# Altium project Hrafn.PrjPcb (part 3 of 3)

## Sheet Clock.SchDoc: Hrafn
size Tabloid; DrawnBy: Nicholas Belsten; Organization: MIT; Address1: Route 40; Address2: Westford MA 01886; Address3: USA; DocumentNumber: 6; Revision: 1.4; SheetNumber: 8; SheetTotal: 10; DCN: Aika; ProgramName: AERO-VISTA; Section: Clock
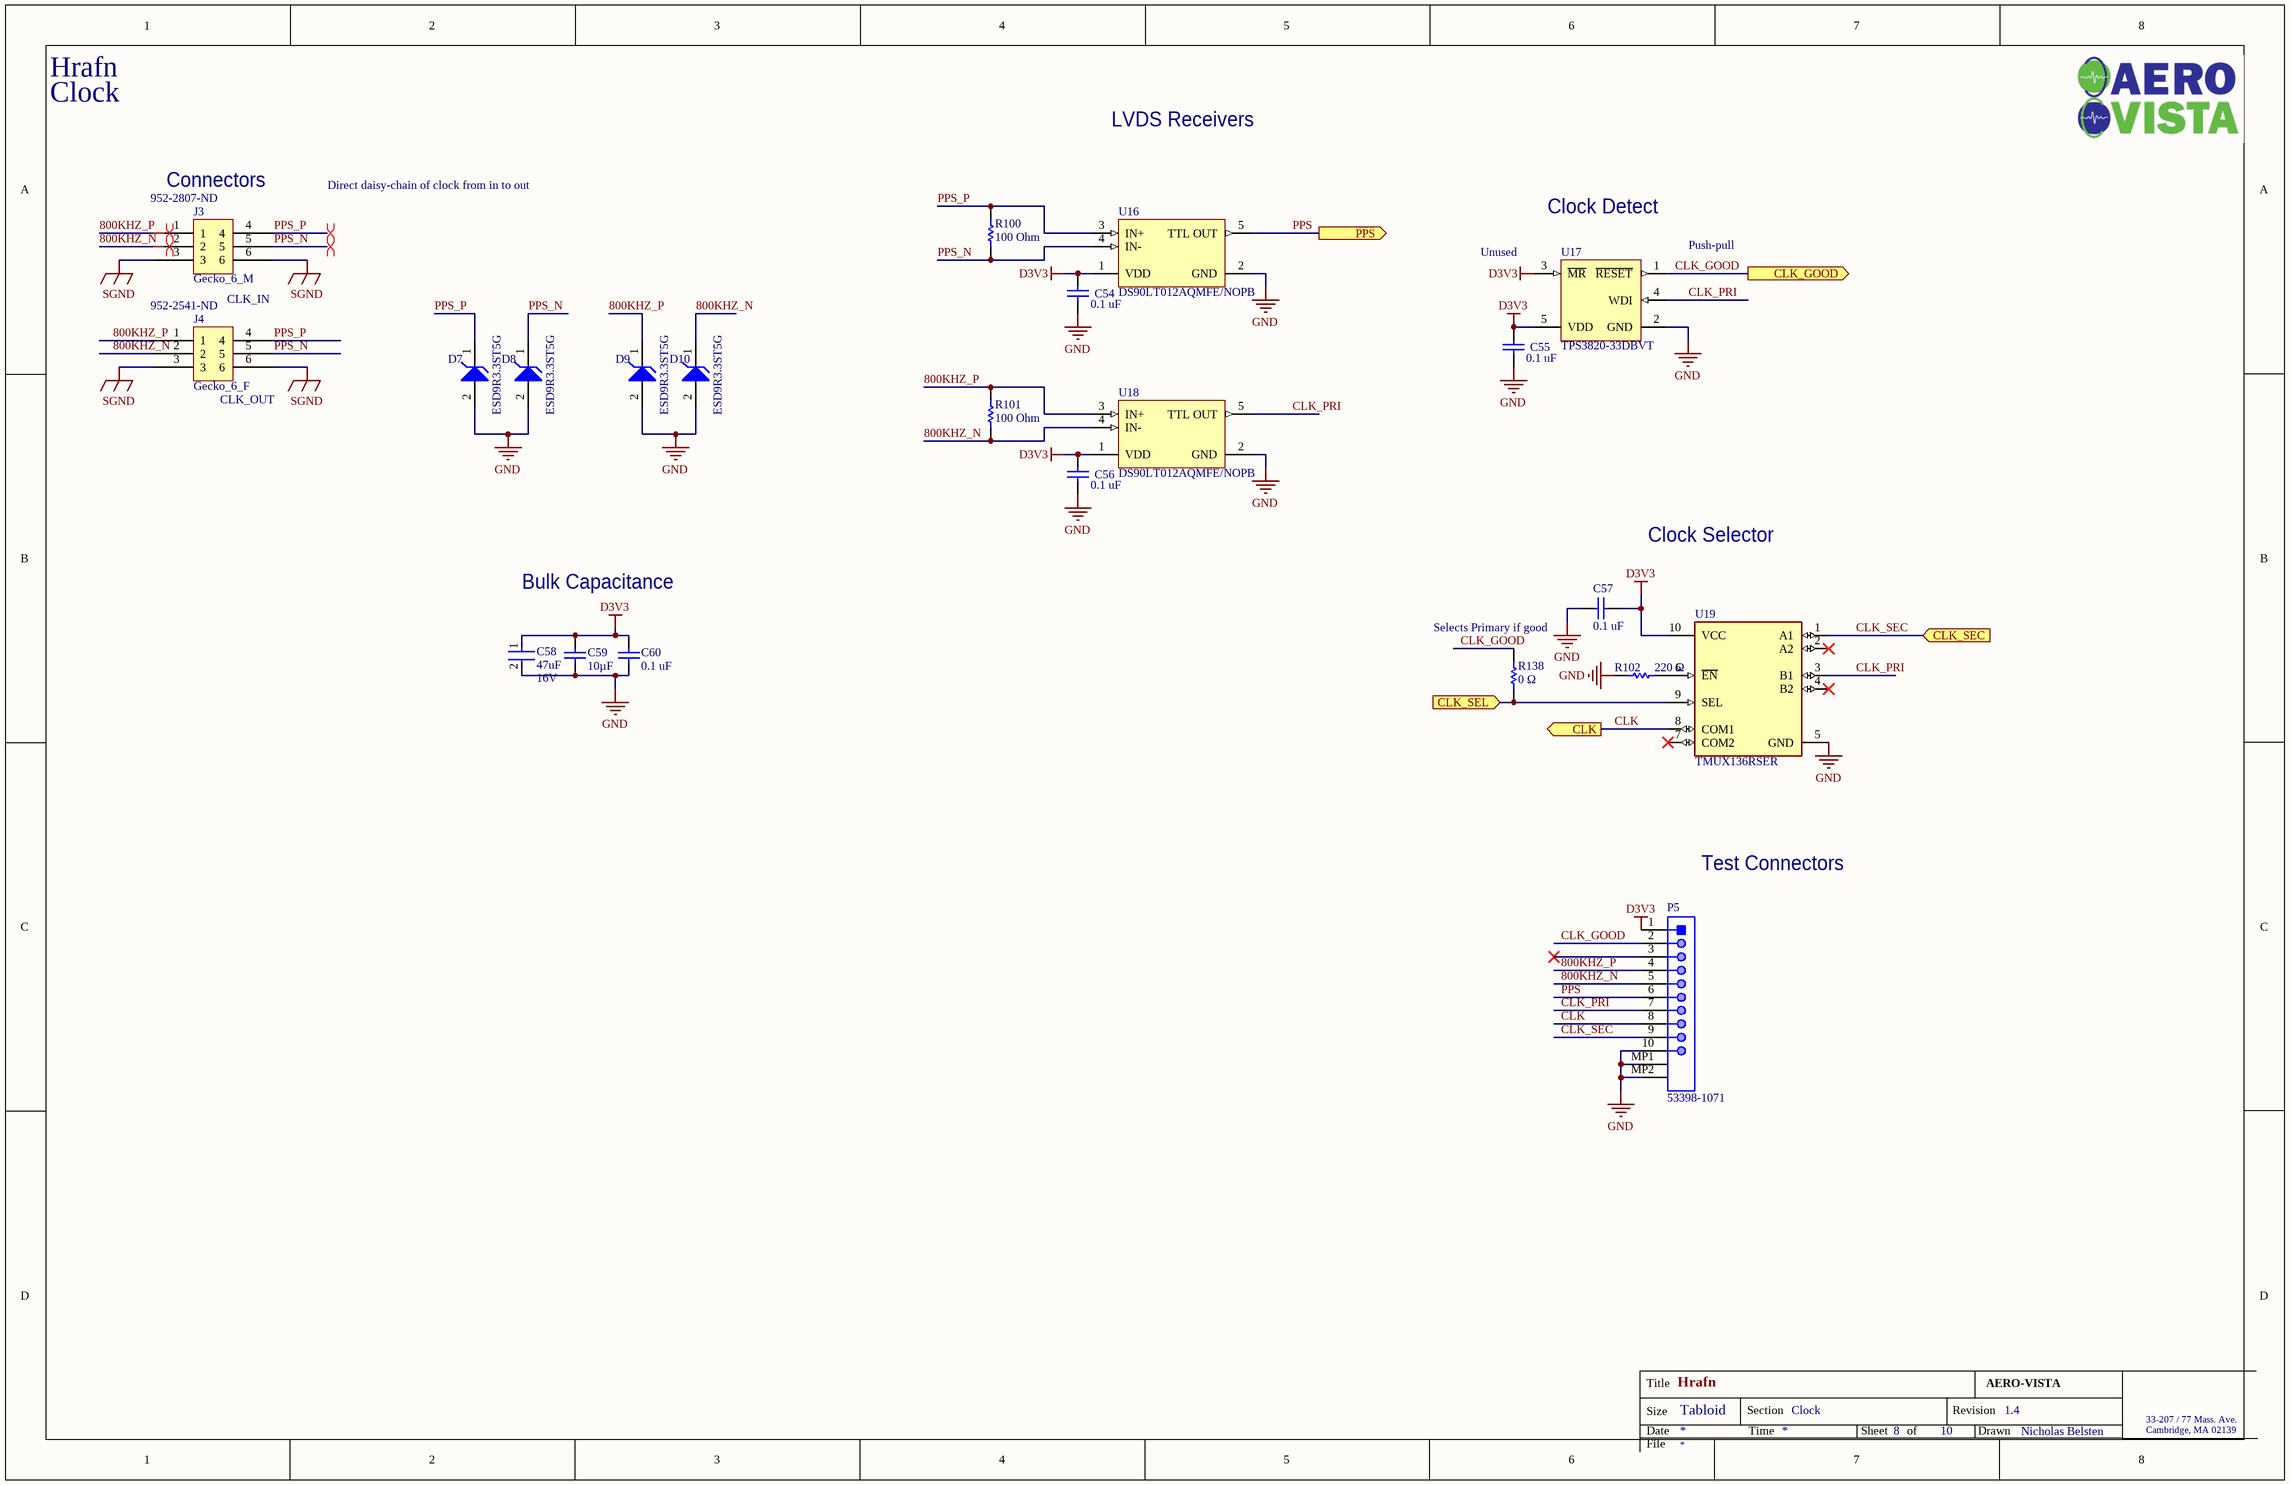
[diagram p8: Clock.SchDoc]

### Parts
C54  0.1 uF  [CAPC0402(1005)60_L]
C55  0.1 uF  [CAPC0402(1005)60_L]
C56  0.1 uF  [CAPC0402(1005)60_L]
C57  0.1 uF  [CAPC0402(1005)60_L]
C58  Capacitance: 47uF  Voltage Rating: 16V  [FP-GRT32E-0_3-IPC_C]  (hidden comment: GRT32EC81C476ME13L)
C59  Capacitance: 10µF  [CAPC1608X100X35LL20T25]  (hidden comment: EMK107BBJ106MA-T)
C60  0.1 uF  [CAPC0402(1005)60_L]
D7  ESD9R3.3ST5G  [ONSC-SOD-923-2-514AB-01_V]
D8  ESD9R3.3ST5G  [ONSC-SOD-923-2-514AB-01_V]
D9  ESD9R3.3ST5G  [ONSC-SOD-923-2-514AB-01_V]
D10  ESD9R3.3ST5G  [ONSC-SOD-923-2-514AB-01_V]
J3  Gecko_6_M  Supplier Part Number 1: 952-2807-ND  [GECK6_M]
J4  Gecko_6_F  Supplier Part Number 1: 952-2541-ND  [GECK6_F]
P5  53398-1071  [MOLX-53398-1071_V]
R100  100 Ohm  [RESC1005X40X25LL05T05]
R101  100 Ohm  [RESC1005X40X25LL05T05]
R102  220 Ω  [RESC1005X40X25LL05T05]
R138  Resistance: 0 Ω  [RESC1005X40X25LL05T05]  (hidden comment: ERJ2GE0R00X)
U16  DS90LT012AQMFE/NOPB  [MF05A_L]
U17  TPS3820-33DBVT  [DBV0005A_N]
U18  DS90LT012AQMFE/NOPB  [MF05A_L]
U19  TMUX136RSER  [FP-RSE0010A-MFG]

### Ports
CLK (out), CLK_GOOD (out), CLK_SEC (in), CLK_SEL (in), PPS (out)

### Nets
D3V3: C54.2 C55.2 C56.2 C57.1 C58.1 C59.2 C60.2 P5.1 U16.1(VDD) U17.3(~{MR}) U17.5(VDD) U18.1(VDD) U19.10(VCC)
GND: C54.1 C55.1 C56.1 C57.2 C58.2 C59.1 C60.1 D7.2(A) D8.2(A) D9.2(A) D10.2(A) P5.10 P5.MP1 P5.MP2 R102.1 U16.2(GND) U17.2(GND) U18.2(GND) U19.5(GND)  [project net DGND]
SGND: J3.3 J3.6 J4.3 J4.6
800KHZ_N: D10.1(K) J3.2 J4.2 P5.5 R101.1 U18.4(IN-)
800KHZ_P: D9.1(K) J3.1 J4.1 P5.4 R101.2 U18.3(IN+)
CLK: P5.8 U19.8(COM1) ; port CLK
CLK_GOOD: P5.2 R138.2 U17.1(~{RESET}) ; port CLK_GOOD
CLK_PRI: P5.7 U17.4(WDI) U18.5(TTL_OUT) U19.3(B1)
CLK_SEC: P5.9 U19.1(A1) ; port CLK_SEC
CLK_SEL: R138.1 U19.9(SEL) ; port CLK_SEL
PPS: P5.6 U16.5(TTL_OUT) ; port PPS
PPS_N: D8.1(K) J3.5 J4.5 R100.1 U16.4(IN-)
PPS_P: D7.1(K) J3.4 J4.4 R100.2 U16.3(IN+)
NetR102_2: R102.2 U19.6(~{EN})

Not connected (* = marked no-connect by the designer): P5 3*; U19 2(A2)* 4(B2)* 7(COM2)*

### Layout directives
differential pair; differential pair class LVDS: 800KHZ_N, 800KHZ_P, PPS_N, PPS_P

### Notes on the sheet
- LVDS Receivers
- (near J3) Connectors
- Direct daisy-chain of clock from in to out
- Clock Detect
- CLK_IN
- (near U17) Unused
- (near U17) Push-pull
- (near J4) CLK_OUT
- Clock Selector
- Bulk Capacitance
- Selects Primary if good
- Test Connectors
- Title
- Size
- Date
- Tabloid
- Section
- Time
- Sheet
- of
- Revision
- Drawn
- 33-207 / 77 Mass. Ave.
- Cambridge, MA 02139
- File

### Library data of the parts
C54-C57 C60 = CMP-1034-02068-1: CAP 100nF 16V ±5% 0402 (1005 Metric) Thickness 0.6mm SMD; Tolerance: Â±5%; Case-EIA: 0402; Case-Metric: 1005; Technology: SMT; Value: 100nF; Max Thickness: 0.6 mm; Rated Voltage: 16 V
C58 = CMP-06035-034903-1: Multi-Layer Ceramic Capacitor 47uF 16V X6S ±20% 1210 Emboss T/R; Ratings: AEC-Q200; Thickness: 0.106inch; Max Operating Temperature: 105°C; Width: 0.098inch; Case/Package: 1210; Length: 0.126inch; Mount: Surface Mount; Min Operating Temperature: -55°C; Tolerance: 20%; Case Code (Imperial): 1210; Case Code (Metric): 3225; Packaging: Tape and Reel
C59 = CMP-2000-06226-1: Chip Capacitor, 10 uF, +/- 20%, 16 V, -55 to 85 degC, 0603 (1608 Metric), RoHS, Tape and Reel; Manufacturer: Taiyo Yuden; Voltage - Rated: 16V; Temperature Coefficient: X5R; Other Names: 587-3238-6; Online Catalog: MSeries; Features: -; Thickness (Max): 0.031"(0.80mm); Package / Case: 0603(1608Metric); Datasheet URL: http://www.yuden.co.jp/ut/product/category/capacitor/EMK107BBJ106MA-T.pdf; Category: Capacitors; Lead Style: -; Family: CeramicCapacitors; Package Description: 2-Pin Surface Mount Device, Body 1.70 x 0.90 mm; Tolerance: ±20%; Manufacturer URL: http://www.t-yuden.com/; Operating Temperature: -55°C~85°C; Lead Spacing: -; Height - Seated (Max): -; Series: M; Applications: GeneralPurpose; Size / Dimension: 0.063"Lx0.031"W(1.60mmx0.80mm); Standard Package: 1; Packaging: Digi-Reel®; Mounting Technology: SurfaceMount; Package Reference: 0603; Ratings: -; Datasheet Version: 10/2016; Mounting Type: SurfaceMount,MLCC
D7-D10 = CMP-1063-00117-1: Transient Voltage Suppressor, ESD Protection Diode with Ultra-Low Leakage, 2-Pin SOD-923, Pb-Free, Tape and Reel; Manufacturer: On Semiconductor; C Max (pF): 0.9; V(BR) Min (V): 4.8; Number of Lines: 1; Direction: Unidirectional; IR Max (uA): 0.001; VRWM Max (V): 3.3; PackageReference: SOD-923-2-514AB-01; ComponentLink3URL: http://www.onsemi.com/pub_link/Collateral/514AB.PDF; DatasheetVersion: Rev. 1; PackageDescription: 2-Pin SOD, Body 0.8 x 0.6 mm; ComponentLink1URL: http://www.onsemi.com/; ComponentLink2Description: Datasheet; ComponentLink3Description: Package Specification; Packing: Tape and Reel; ComponentLink1Description: Manufacturer URL; ComponentLink2URL: http://www.onsemi.com/pub_link/Collateral/ESD9R3.3S-D.PDF; RoHS: Pb-Free; PackageVersion: Rev. C, 03/2011; Mounting Technology: Surface Mount; PartNumber: ESD9R3.3ST5G
J3 = Gecko_6_M: CONN HEADER VERT 6POS 1.25MM; Manufacturer 1: Harwin; Manufacturer Part Number 1: G125-MV10605L1P; Number of Positions: 6; Connector Type: Male Pin,Pin; Insulation Resistance: 10GR; Current Rating: 2A; Voltage Rating: 450V; Pitch: 0.049inch; Supplier 1: Digi-Key; RoHS: Yes; Category: Headers and Wire Housings; Stock 1: 132; Pricing 1: 1=4.22000, 10=4.04600, 100=3.37200, 500=2.86620, 1000=2.44470, 5000=2.19180 (USD); Mount: Through Hole; Color: Green; Weight: 0.008184oz; Housing Material: Polyamide; Contact Plating: Gold; Contact Material: Bronze; Min Operating Temperature: -65°C; Max Operating Temperature: 150°C; Packaging: Cut Strip; Termination: Solder; Fastening Type: Latch; Package Quantity: 1; Number of Rows: 2; Row Spacing: 0.049inch; Flammability Rating: UL94 V-0; ComponentLink1URL: http://www.mouser.com/ds/2/181/C125XX_G125_Gecko_Connectors-1131202.pdf?src-supplier=Mouser; ComponentLink1Description: http://www.mouser.com/ds/2/181/C125XX_G125_Gecko_Connectors-1131202.pdf?src-supplier=Mouser; ComponentLink2URL: https://cdn.harwin.com/pdfs/G125-MVXXX05LXP.pdf?src-supplier=Digi-Key; ComponentLink2Description: https://cdn.harwin.com/pdfs/G125-MVXXX05LXP.pdf?src-supplier=Digi-Key
J4 = Gecko_6_F: Gecko DIL Female Vertical 3mm PC Tail Connector, gold, pick & place (cut tape packing), 3+3 contacts; Manufacturer 1: Harwin; Manufacturer Part Number 1: G125-FV10605L0P; Current Rating: 2A; Voltage Rating: 450V; Connector Type: Receptacle,Socket; Number of Positions: 6; Insulation Resistance: 10GR; Pitch: 0.049inch; Supplier 1: Digi-Key; RoHS: Yes; Category: Headers and Wire Housings; Stock 1: 4137; Pricing 1: 1=6.94000, 10=6.64700, 100=5.49100, 500=4.62400, 1000=4.04600, 5000=3.75700 (USD); Mount: Through Hole; Housing Material: Polyamide; Contact Plating: Gold; Contact Material: Copper Alloy; Weight: 0.006843oz; Min Operating Temperature: -65°C; Max Operating Temperature: 150°C; Packaging: Bulk; Number of Rows: 2; Contact Gender: Female; Termination: Solder; Package Quantity: 1; Row Spacing: 0.049inch; Contact Post Length: 3mm; Flammability Rating: UL94 V-0; ComponentLink1URL: http://www.farnell.com/datasheets/1805453.pdf?src-supplier=Farnell; ComponentLink1Description: http://www.farnell.com/datasheets/1805453.pdf?src-supplier=Farnell; ComponentLink2URL: http://www.mouser.com/ds/2/181/C125XX_G125_Gecko_Connectors-1131202.pdf?src-supplier=Mouser; ComponentLink2Description: http://www.mouser.com/ds/2/181/C125XX_G125_Gecko_Connectors-1131202.pdf?src-supplier=Mouser; ComponentLink3URL: https://cdn.harwin.com/pdfs/G125-FVXXX05L0P.pdf?src-supplier=Digi-Key; ComponentLink3Description: https://cdn.harwin.com/pdfs/G125-FVXXX05L0P.pdf?src-supplier=Digi-Key; Parameter 1: *
P5 = CMP-2000-05635-1: Male Header, Pitch 1.25 mm, 1 x 10 Position, Height 4.7 mm, -40 to 85 degC, RoHS, Tape and Reel; Manufacturer: Molex; Mounting Angle: Vertical; Pitch: 1.25mm; Voltage Rating: 125V; Current Rating: 1A; Number of Rows: 1Row; Housing Material: Nylon; Mounting Technology: SurfaceMount; Mounting Style: SMD; Contact Material: PhosphorBronze; Product: Headers; Datasheet URL: http://www.molex.com/pdm_docs/sd/533981071_sd.pdf; Manufacturer URL: http://www.molex.com/; Datasheet Version: Rev. J, 09/2015; Factory Pack Quantity: 1000; Brand: Molex; Packaging: Reel; Product Category: Headers&WireHousings; Contact Gender: Pin(Male); Number of Positions: 10Position; RoHS: Details; Contact Plating: Tin; Package Description: Male Header, Pitch 1.25 mm, 1 x 10 Position, Height 4.7 mm; Series: 53398; Type: Shrouded; Package Reference: 53398-1071; Tradename: PicoBlade; Termination Style: SMD
R100 R101 = CMP-2002-00605-3: Chip Resistor, 100 Ohm, +/- 1%, 100 mW, -55 to 155 degC, 0402 (1005 Metric), RoHS, Tape and Reel; Manufacturer: Basic Passives; PartNumber: ERJ-2RKF1000X; Power Rating: 100 mW; Voltage Rating: 50 V; Case\/Package: 0402; Width: 0.5 mm; Pins: 2; ComponentLink2Description: Datasheet; PackageReference: 0402; Height: 0.35 mm; Tolerance: 1%; DatasheetVersion: 04/2015; Case Code (Imperial): 0402; Min Operating Temperature: -55 degC; Radiation Hardening: No; Length: 1 mm; Package Quantity: 10000; PackageDescription: 2-Pin Surface Mount Device, Body 1 x 0.5 mm; Mounting Technology: Surface Mount; Case Code (Metric): 1005; Packaging: Tape and Reel; ComponentLink1URL: http://www.panasonic.com/; RoHSCompliant: true; Max Operating Temperature: 155 degC; REACH SVHC: Yes; ComponentLink1Description: Manufacturer URL; Resistance: 100 Ohm; ComponentLink2URL: http://industrial.panasonic.com/cdbs/www-data/pdf/RDA0000/AOA0000C86.pdf; Mount: Surface Mount
R102 = CMP-2002-08356-1: Part Number: CRCW040220K0FKED; Manufacturer: Vishay Dale; Resistance: 220 Ω
R138 = CMP-2000-07451-1: Chip Resistor, 0 Ohm, 0.1 W, -55 to 155 degC, 0402 (1005 Metric), RoHS, Tape and Reel; Manufacturer: Panasonic; Voltage Rating (DC): 50V; Temperature Coefficient: 600ppm/��C; Max Power Dissipation: 100mW; Tolerance: 5%; Number of Terminations: 2; Mount: SurfaceMount; Height: 0.35mm; Packaging: TapeandReel; Contact Plating: Tin; Manufacturer URL: http://www.panasonic.com/; Composition: ThickFilm; Max Operating Temperature: 155degC; REACH SVHC: NoSVHC; Case/Package: 0402; Package Reference: 402; Depth: 0.5mm; Package Description: 2-Pin Surface Mount Device, Body 1 x 0.5 mm; Datasheet URL: https://industrial.panasonic.com/cdbs/www-data/pdf/RDA0000/AOA0000C301.pdf; RoHSCompliant: True; Case Code (Imperial): 0402; Military Standard: Not; Min Operating Temperature: -55degC; Power Rating: 100mW; Datasheet Version: 03/2015; Length: 1mm; Case Code (Metric): 1005; Termination: SMD/SMT; Mounting Technology: SurfaceMount; Voltage Rating: 50V; Width: 0.02inch; Package Quantity: 1; Lead Free: LeadFree; Radiation Hardening: No
U16 U18 = CMP-0058-01130-2: Automotive LVDS Differential Line Receiver, 5-pin SOT-23, Pb-Free; Manufacturer: National Semiconductor; PackageTopMarking: N03Q*XTT; CompType: Interface IC; PowerWise: N; ComponentLink3Description: MF05A Package Page; PackageVersion: revD, Aug-2008; ComponentLink2URL: http://www.national.com/pf/DS/DS90LT012AQ.html; RevisionNote: Component URLs added; PackageReference: MF05A; DatasheetVersion: Oct-2008; RoHS: Y; ComponentLink2Description: DS90LT012AQ Web Page; ComponentLink3URL: http://www.national.com/packaging/folders/mf05a.html; ComponentLink1URL: http://www.national.com/ds/DS/DS90LT012AQ.pdf; PinCount: 5; PackageDescription: Molded SOT-23, .115 x .063 x .040 in Body, 5 Lead, .0375 in Pitch; ComponentLink1Description: DS90LT012AQ Datasheet
U17 = CMP-0338-00013-2: Processor Supervisory Circuit, 1 Supply Monitored, -40 to 85 degC, 5-Pin SOT-23 (DBV), Green (RoHS & no Sb/Br); Manufacturer: Texas Instruments; Rating: Catalog; Time Delay: 25 ms; # of Supplies Monitored: 1; Output Driver Type / Reset Output: Active-low, Push-pull; Reset Threshold Accuracy: 2.4%; Threshold Voltage: 2.93 V Typ.; Watchdog Timer WDI: 0.2 s; Packing: Tape and Reel; VCC: 1.1 V Min.; Iq: 15 uA Typ.; Operating Temperature Range: -40 to 85 degC; RoHS: TRUE; DatasheetVersion: SLVS165J; PackageDescription: 5-Pin Plastic Small Outline, Body 1.6 x 2.9 mm, Pitch 0.95 mm; ComponentLink1URL: www.ti.com; Mounting Technology: Surface Mount; PartNumber: TPS3820-33DBVT; PackageVersion: 4073253-4/L; ComponentLink1Description: Manufacturer URL; ComponentLink3URL: http://www.ti.com/lit/ml/mpds018j/mpds018j.pdf; ComponentLink3Description: Package Specification; ComponentLink2Description: Datasheet; PackageReference: DBV0005A; ComponentLink2URL: http://www.ti.com/lit/ds/symlink/tps3820-33.pdf
U19 = CMP-04892-000024-1: IC SWITCH SPDT DUAL 10UQFN; Manufacturer: Texas Instruments; Max Supply Voltage: 4.8V; Number Of Circuits: 2; On State Resistance: 4.6/5.7Ω; Nominal Supply Current: 30uA; -3Db Bandwith: 6.1GHz; Mux Demux Ratio: 2:1; Standoff Height: 0mm; Min Supply Voltage: 2.3V; Description: 2 Circuit IC Switch 2:1 9.5Ohm 10-UQFN (2.0x1.5); Automotive: No; Temperature Range Low: -40°C; Throw Configuration: SPDT; Lead Free: Yes; Ipc Land Pattern Name: QFN50P150X200X55-10; Mouser Description: Dual SPDT, Low-Capacitance, 6.1 GHz Analog Switch 10-UQFN -40 to 85; Device Class L1: Integrated Circuits (ICs); Temperature Range High: +85°C; Package: RSE0010A; Manufacturer Part Number: TMUX136RSER; Ambient Temperature Range Low: -40°C; ComponentLink2Description: Datasheet; Octopart: https://octopart.com/tmux136rser-texas+instruments-86728646; Device Class L3: Analog Switches; Ambient Temperature Range High: +85°C; Category: IC; RoHS: TRUE; Device Class L2: Interface ICs; Temperature: -40°C to +85°C; Height: 0.6mm; Digikey Description: IC SWITCH SPDT DUAL 10UQFN; ComponentLink2URL: http://www.ti.com/lit/ds/symlink/tmux136.pdf; Footprint Url: http://www.ti.com/lit/ds/symlink/ts3a24157.pdf

## Sheet Ethernet.SchDoc: Hrafn
size Tabloid; DrawnBy: Nicholas Belsten; Organization: MIT; Address1: Route 40; Address2: Westford MA 01886; Address3: USA; DocumentNumber: 7; Revision: 1.4; SheetNumber: 9; SheetTotal: 10; DCN: Aika; ProgramName: AERO-VISTA; Section: Ethernet
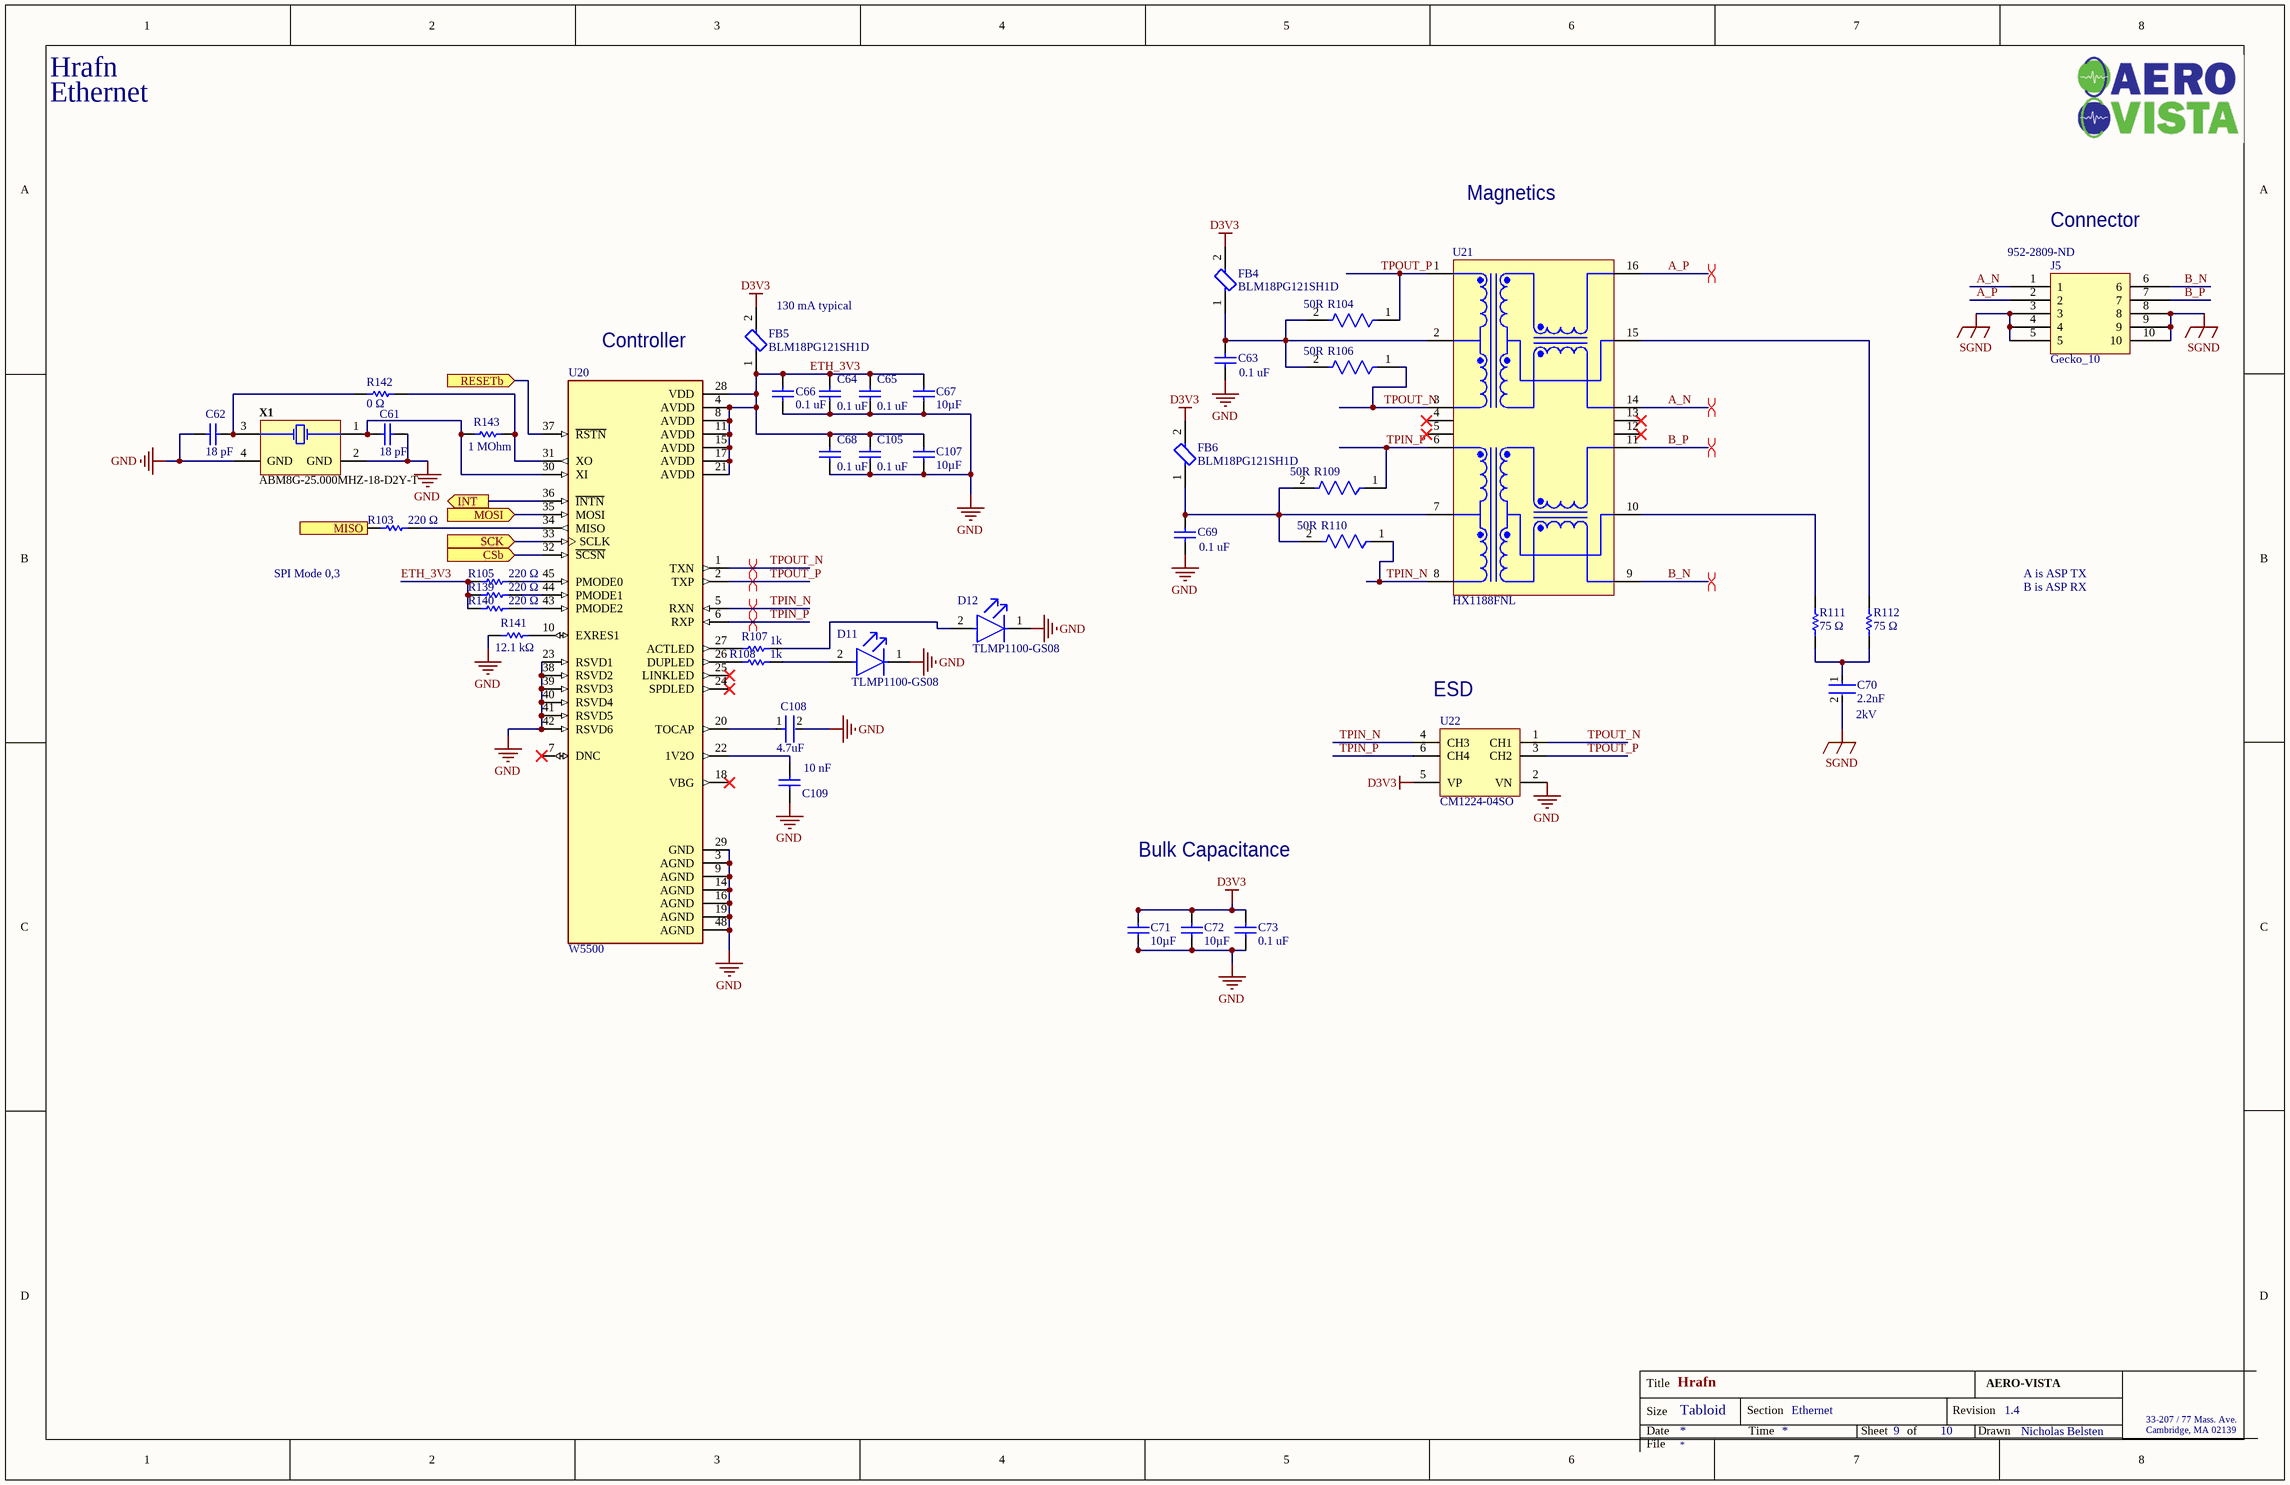
[diagram p9: Ethernet.SchDoc]

### Parts
C61  Capacitance: 18 pF  [CAPC1005X55X25LL05T10]  (hidden comment: GRM1555C1H180JA01D)
C62  Capacitance: 18 pF  [CAPC1005X55X25LL05T10]  (hidden comment: GRM1555C1H180JA01D)
C63  0.1 uF  [CAPC0402(1005)60_L]
C64  0.1 uF  [CAPC0402(1005)60_L]
C65  0.1 uF  [CAPC0402(1005)60_L]
C66  0.1 uF  [CAPC0402(1005)60_L]
C67  Capacitance: 10µF  [CAPC1608X100X35LL20T25]  (hidden comment: EMK107BBJ106MA-T)
C68  0.1 uF  [CAPC0402(1005)60_L]
C69  0.1 uF  [CAPC0402(1005)60_L]
C70  2.2nF  Voltage Rating (DC): 2kV  [FP-CGA6P-MFG]
C71  Capacitance: 10µF  [CAPC1608X100X35LL20T25]  (hidden comment: EMK107BBJ106MA-T)
C72  Capacitance: 10µF  [CAPC1608X100X35LL20T25]  (hidden comment: EMK107BBJ106MA-T)
C73  0.1 uF  [CAPC0402(1005)60_L]
C105  0.1 uF  [CAPC0402(1005)60_L]
C107  Capacitance: 10µF  [CAPC1608X100X35LL20T25]  (hidden comment: EMK107BBJ106MA-T)
C108  Capacitance: 4.7uF  [FP-GRM188-0_2-IPC_C]  (hidden comment: GRM188R6YA475KE15D)
C109  Capacitance: 10 nF  [CAPC1005X55X25LL05T10]  (hidden comment: GRM155R71E103KA01D)
D11  TLMP1100-GS08  [FP-6_541-5056_01-4-MFG]
D12  TLMP1100-GS08  [FP-6_541-5056_01-4-MFG]
FB4  BLM18PG121SH1D  [FP-BLM18-0_15-t0_8-IPC_C]
FB5  BLM18PG121SH1D  [FP-BLM18-0_15-t0_8-IPC_C]
FB6  BLM18PG121SH1D  [FP-BLM18-0_15-t0_8-IPC_C]
J5  Gecko_10  Supplier Part Number 1: 952-2809-ND  [GECK10-dup]
R103  220 Ω  [RESC1005X40X25LL05T05]
R104  Resistance: 50R  [FP-CRCW0603-e3-MFG]  (hidden comment: CRCW060350R0FKEA)
R105  220 Ω  [RESC1005X40X25LL05T05]
R106  Resistance: 50R  [FP-CRCW0603-e3-MFG]  (hidden comment: CRCW060350R0FKEA)
R107  Resistance: 1k  [RESC1005X40X25LL05T05]  (hidden comment: ERJ-2GEJ102X)
R108  Resistance: 1k  [RESC1005X40X25LL05T05]  (hidden comment: ERJ-2GEJ102X)
R109  Resistance: 50R  [FP-CRCW0603-e3-MFG]  (hidden comment: CRCW060350R0FKEA)
R110  Resistance: 50R  [FP-CRCW0603-e3-MFG]  (hidden comment: CRCW060350R0FKEA)
R111  75 Ω  [RESC1005X40X25NL05T05]
R112  75 Ω  [RESC1005X40X25NL05T05]
R139  220 Ω  [RESC1005X40X25LL05T05]
R140  220 Ω  [RESC1005X40X25LL05T05]
R141  Resistance: 12.1 kΩ  [RESC1005X40X25LL05T05]  (hidden comment: ERJ-2RKF1212X)
R142  Resistance: 0 Ω  [RESC1005X40X25LL05T05]  (hidden comment: ERJ2GE0R00X)
R143  Resistance: 1 MOhm  [RESC1005X37X25LL05T10]  (hidden comment: AC0402FR-071ML)
U20  W5500  [TSQFP50P900X900X160-48L]
U21  HX1188FNL  [PULS-HX1188FNL-SMT-16_V]
U22  CM1224-04SO  [ONSC-SOT23-6-527AJ_V]
X1  ABM8G-25.000MHZ-18-D2Y-T  [ABRA-ABM8G_V]

### Ports
CSb (in), INT (out), MISO (out), MOSI (in), RESETb (in), SCK (in)

### Nets
D3V3: C71.2 C72.2 C73.2 FB4.2 FB5.2 FB6.2 U22.5(VP)
GND: C61.1 C62.2 C63.1 C64.1 C65.1 C66.2 C67.2 C68.1 C69.1 C71.1 C72.1 C73.1 C105.1 C107.2 C108.2 C109.1 D11.1(C) D12.1(C) R141.1 U20.3(AGND) U20.9(AGND) U20.14(AGND) U20.16(AGND) U20.19(AGND) U20.23(RSVD1) U20.29(GND) U20.38(RSVD2) U20.39(RSVD3) U20.40(RSVD4) U20.41(RSVD5) U20.42(RSVD6) U20.48(AGND) U22.2(VN) X1.2(GND) X1.4(GND)  [project net DGND]
SGND: C70.2 J5.3 J5.4 J5.5 J5.8 J5.9 J5.10
A_N: J5.1 U21.14(TX-)
A_P: J5.2 U21.16(TX+)
B_N: J5.6 U21.9(RX-)
B_P: J5.7 U21.11(RX+)
ETH_3V3: C64.2 C65.2 C66.1 C67.1 C68.2 C105.2 C107.1 FB5.1 R105.1 R139.1 R140.1 U20.4(AVDD) U20.8(AVDD) U20.11(AVDD) U20.15(AVDD) U20.17(AVDD) U20.21(AVDD) U20.28(VDD)
ETH_CSb: U20.32(~{SCSN}) ; port CSb
ETH_INT: U20.36(~{INTN}) ; port INT
ETH_RESETb: U20.37(~{RSTN}) ; port RESETb
MISO0: R103.1 ; port MISO
MOSI0: U20.35(MOSI) ; port MOSI
SCLK0: U20.33(SCLK) ; port SCK
TPIN_N: R110.1 U20.5(RXN) U21.8(RD-) U22.4(CH3)
TPIN_P: R109.1 U20.6(RXP) U21.6(RD+) U22.6(CH4)
TPOUT_N: R106.1 U20.1(TXN) U21.3(TD-) U22.1(CH1)
TPOUT_P: R104.1 U20.2(TXP) U21.1(TD+) U22.3(CH2)
NetC61_2: C61.2 R143.1 U20.30(XI) X1.1(X1)
NetC62_1: C62.1 R142.2 X1.3(X2)
NetC63_2: C63.2 FB4.1 R104.2 R106.2 U21.2(TCT)
NetC69_2: C69.2 FB6.1 R109.2 R110.2 U21.7(RCT)
NetC70_1: C70.1 R111.1 R112.1
NetC108_1: C108.1 U20.20(TOCAP)
NetC109_2: C109.2 U20.22(1V2O)
NetD11_2: D11.2(A) R108.2
NetD12_2: D12.2(A) R107.2
NetR103_2: R103.2 U20.34(MISO)
NetR105_2: R105.2 U20.45(PMODE0)
NetR107_1: R107.1 U20.27(ACTLED)
NetR108_1: R108.1 U20.26(DUPLED)
NetR111_2: R111.2 U21.10(CMT)
NetR112_2: R112.2 U21.15(CMT)
NetR139_2: R139.2 U20.44(PMODE1)
NetR140_2: R140.2 U20.43(PMODE2)
NetR141_2: R141.2 U20.10(EXRES1)
NetR142_1: R142.1 R143.2 U20.31(XO)

Not connected (* = marked no-connect by the designer): U20 7(DNC)* 18(VBG)* 24(SPDLED)* 25(LINKLED)*; U21 4(NC)* 5(NC)* 12(NC)* 13(NC)*

### Layout directives
differential pair; differential pair class ETH: A_N, A_P, B_N, B_P, TPIN_N
differential pair; differential pair class ETH; differential pair class ETH: TPIN_P, TPOUT_N, TPOUT_P

### Notes on the sheet
- Magnetics
- Connector
- Controller
- (near FB5) 130 mA typical
- (near R103) SPI Mode 0,3
- A is ASP TX
- B is ASP RX
- (near U22) ESD
- Bulk Capacitance
- Title
- Size
- Date
- Tabloid
- Section
- Time
- Sheet
- of
- Revision
- Drawn
- 33-207 / 77 Mass. Ave.
- Cambridge, MA 02139
- File

### Library data of the parts
C61 C62 = CMP-2008-03918-1: Manufacturer: Murata; Part Number: GRM1555C1H180JA01D
C63-C66 C68 C69 C73 C105 = CMP-1034-02068-1: as C54-C57 on sheet Clock; Technology: SMT; Value: 100nF; Max Thickness: 0.6 mm; Rated Voltage: 16 V
C67 C71 C72 C107 = CMP-2000-06226-1: as C59 on sheet Clock; Features: -; Thickness (Max): 0.031"(0.80mm); Package / Case: 0603(1608Metric); Datasheet URL: http://www.yuden.co.jp/ut/product/category/capacitor/EMK107BBJ106MA-T.pdf; Category: Capacitors; Lead Style: -; Family: CeramicCapacitors; Package Description: 2-Pin Surface Mount Device, Body 1.70 x 0.90 mm; Tolerance: ±20%; Manufacturer URL: http://www.t-yuden.com/; Operating Temperature: -55°C~85°C; Lead Spacing: -; Height - Seated (Max): -; Series: M; Applications: GeneralPurpose; Size / Dimension: 0.063"Lx0.031"W(1.60mmx0.80mm); Standard Package: 1; Packaging: Digi-Reel®; Mounting Technology: SurfaceMount; Package Reference: 0603; Ratings: -; Datasheet Version: 10/2016; Mounting Type: SurfaceMount,MLCC
C70 = CMP-08246-001831-1: Cap Ceramic 2.2nF 2000V X7S 20% Pad SMD 1210 +125°C Automotive T/R; Mount: Surface Mount; Case/Package: 1210; Case Code (Imperial): 1210; Package Quantity: 1000; Min Operating Temperature: -55°C; Packaging: Tape and Reel; Max Operating Temperature: 125°C; Height: 2.5mm; Length: 0.126inch; Weight: 0.000564oz; Ratings: AEC-Q200; Thickness: 0.11inch; Width: 0.098inch; Tolerance: 20%; Capacitance: 2.2nF; Dielectric: X7S; Case Code (Metric): 3225; Voltage Rating: 2kV
C108 = CMP-2006-02545-2: Chip Multilayer Ceramic Capacitors for General Purpose, 0603, 4.7uF, X5R, 15%, 10%, 35V; Lead Free: Lead Free; Max Operating Temperature: 85°C; Case Code (Imperial): 0603; Width: 0.8mm; Thickness: 0.031inch; Case Code (Metric): 1608; Min Operating Temperature: -55°C; Voltage Rating (DC): 35V; Dielectric: X5R; Voltage: 35V; Packaging: Tape and Reel; Resistor Type: Ceramic; Weight: 0.000222oz; Mount: Surface Mount; Material: Ceramic; Depth: 0.8mm; Tolerance: 10%; REACH SVHC: No SVHC; Case/Package: 0603; Voltage Rating: 35V; Package Quantity: 4000; Height: 0.8mm; Length: 1.6mm; Termination: SMD/SMT
C109 = CMP-1034-01880-2: Manufacturer: Murata; Part Number: GRM155R71E103KA01D
D11 D12 = CMP-02520-000009-1: LED GREEN 0603 SMD; Manufacturer: Vishay; Max Junction Temp: +120°C; Automotive Grade: Grade 3; Reverse Voltage: 6V; Led Orientation: Top View; Forward Voltage: 2.1V; Luminous Intensity: 15mcd; Forward Current: 20mA; Colour: Pure green; Peak Emmision Wavelength: 562nm; Wavelength: 561nm; Viewing Angle: 160°; Power Dissipation: 90mW; Digikey Description: LED GREEN 0603 SMD; Package: 6.541-5056.01-4; Ambient Temperature Range High: +100°C; Height: 0.65mm; Device Class L1: Optoelectronics; Device Class L2: LEDs; Mouser Description: Standard LEDs - SMD Pure Green; Temperature Range High: +120°C; RoHS: TRUE; Ambient Temperature Range Low: -40°C; Temperature: to +120°C; Manufacturer Part Number: TLMP1100-GS08; ComponentLink2URL: http://www.vishay.com/docs/83173/tlmb1100.pdf; Lead Free: Yes; Octopart: https://octopart.com/tlmp1100-gs08-vishay-55433993; Automotive: Yes; Device Class L3: unset; ComponentLink2Description: Datasheet; Category: Diode
FB4-FB6 = CMP-06046-000335-1: Chip Ferrite Bead, 0603, 120Ω @ 100MHz, 0.05Ω, 25%, 2A; Impedance: 120R; Shielding: Unshielded; Number of Lines: 1; DC Resistance (DCR): 50mR; Case/Package: 0603; Max Current Rating: 2A; Ratings: AEC-Q200; Case Code (Metric): 1608; Height: 0.8mm; Max DC Current: 2A; Contact Plating: Tin; Max Operating Temperature: 125°C; Width: 0.031inch; Number of Circuits: 1; Min Operating Temperature: -55°C; Mount: Surface Mount; Test Frequency: 100MHz; Tolerance: 25%; Packaging: Tape and Reel; Length: 1.6mm; Weight: 7.1E-05oz; Package Quantity: 4000; Case Code (Imperial): 0603; Termination: SMD/SMT; Material: Ferrite; Depth: 0.8mm; Lead Free: Lead Free; Current Rating: 2A
J5 = Gecko_10: Headers & Wire Housings 1.25MM M VERT 3.0MM 2x5 POS; Manufacturer 1: Harwin; Manufacturer Part Number 1: G125-MV11005L1P; Current Rating: 2A; Voltage Rating: 450V; Connector Type: Pin,Male Pin; Number of Positions: 10; Insulation Resistance: 10GR; Pitch: 0.049inch; Supplier 1: Digi-Key; RoHS: Yes; Category: Headers and Wire Housings; Stock 1: 486; Pricing 1: 1=4.73000, 10=4.53800, 100=3.78200, 500=3.21470, 1000=2.74195, 5000=2.45830 (USD); Mount: Through Hole; Contact Plating: Gold; Contact Material: Bronze; Housing Material: Polyamide; Weight: 0.010864oz; Color: Green; Min Operating Temperature: -65°C; Max Operating Temperature: 150°C; Number of Rows: 2; Termination: Solder; Package Quantity: 1; Packaging: Cut Strip; Fastening Type: Latch; Row Spacing: 0.049inch; Flammability Rating: UL94 V-0; ComponentLink1URL: http://www.mouser.com/ds/2/181/C125XX_G125_Gecko_Connectors-1131202.pdf?src-supplier=Mouser; ComponentLink1Description: http://www.mouser.com/ds/2/181/C125XX_G125_Gecko_Connectors-1131202.pdf?src-supplier=Mouser; ComponentLink2URL: https://cdn.harwin.com/pdfs/G125-MVXXX05LXP.pdf?src-supplier=Digi-Key; ComponentLink2Description: https://cdn.harwin.com/pdfs/G125-MVXXX05LXP.pdf?src-supplier=Digi-Key
R103 R105 R139 R140 = CMP-2002-08356-1: as R102 on sheet Clock; Resistance: 220 Ω
R104 = CMP-2000-03436-2: RES Thick Film, 50Ω, 1%, 0.1W, 100ppm/°C, 0603; Voltage Rating (DC): 75V; Power Rating: 100mW; Case/Package: 0603; Packaging: Tape and Reel; Military Standard: Not; REACH SVHC: No SVHC; Width: 0.85mm; Max Operating Temperature: 155°C; Case Code (Metric): 1608; Temperature Coefficient: 100ppm/°C; Lead Free: Lead Free; Height: 0.45mm; Composition: Thick Film; Termination: SMD/SMT; Contact Plating: Tin; Number of Pins: 2; Tolerance: 1%; Depth: 0.85mm; Weight: 7.1E-05oz; Min Operating Temperature: -55°C; Length: 1.55mm; Radiation Hardening: No; Voltage Rating: 75V; Case Code (Imperial): 0603; Package Quantity: 5000; Mount: Surface Mount
R106 R109 R110 = CMP-2000-03436-2: RES Thick Film, 50Ω, 1%, 0.1W, 100ppm/°C, 0603; Power Rating: 100mW; Voltage Rating (DC): 75V; Case/Package: 0603; Case Code (Imperial): 0603; Case Code (Metric): 1608; Composition: Thick Film; Contact Plating: Tin; Depth: 0.85mm; Height: 0.45mm; Lead Free: Lead Free; Length: 1.55mm; Max Operating Temperature: 155°C; Military Standard: Not; Min Operating Temperature: -55°C; Mount: Surface Mount; Number of Pins: 2; Package Quantity: 5000; Packaging: Tape and Reel; Radiation Hardening: No; REACH SVHC: No SVHC; Temperature Coefficient: 100ppm/°C; Termination: SMD/SMT; Tolerance: 1%; Voltage Rating: 75V; Weight: 7.1E-05oz; Width: 0.85mm
R107 R108 = CMP-2002-00432-1: Manufacturer: Panasonic; Part Number: ERJ-2GEJ102X
R111 R112 = CMP-2002-01061-1: Manufacturer: Panasonic; Part Number: ERJ-2RKF75R0X; Resistance: 75 Ω
R141 = CMP-2002-00649-1: Manufacturer: Panasonic; Part Number: ERJ-2RKF1212X
R142 = CMP-2000-07451-1: as R138 on sheet Clock; Number of Terminations: 2; Mount: SurfaceMount; Height: 0.35mm; Packaging: TapeandReel; Contact Plating: Tin; Manufacturer URL: http://www.panasonic.com/; Composition: ThickFilm; Max Operating Temperature: 155degC; REACH SVHC: NoSVHC; Case/Package: 0402; Package Reference: 402; Depth: 0.5mm; Package Description: 2-Pin Surface Mount Device, Body 1 x 0.5 mm; Datasheet URL: https://industrial.panasonic.com/cdbs/www-data/pdf/RDA0000/AOA0000C301.pdf; RoHSCompliant: True; Case Code (Imperial): 0402; Military Standard: Not; Min Operating Temperature: -55degC; Power Rating: 100mW; Datasheet Version: 03/2015; Length: 1mm; Case Code (Metric): 1005; Termination: SMD/SMT; Mounting Technology: SurfaceMount; Voltage Rating: 50V; Width: 0.02inch; Package Quantity: 1; Lead Free: LeadFree; Radiation Hardening: No
R143 = CMP-2002-01800-1: Manufacturer: Yageo; Part Number: AC0402FR-071ML
U20 = W5500: Socket Contact Silver 17-20 AWG Crimp Power; MF: WIZnet; Price: None; Package: LQFP-48 WIZnet; Value: *; MP: W5500; Availability: Unavailable; SnapEDA_Link: https://www.snapeda.com/parts/W5500/WIZnet/view-part/45250/?ref=snap
U21 = CMP-2000-06431-1: Telecom Transformer 1:1/1:1, -40 to 85 degC, 16-Pin SMT, RoHS, Tube; Manufacturer: Pulse Electronics; Turns Ratio - Primary: Secondary:1:1Transmitter,1:1Receiver; Online Catalog: HX1188; Other Names: 553-2200; Other Related Documents: PackagesFNLvs.NL; Transformer Type: IsolationandDataInterface(Encapsulated); Datasheet Version: Rev. B, 05/2014; Family: PulseTransformers; PartNumber: HX1188FNL; Manufacturer URL: http://www.pulseelectronics.com/; Package Description: 16-Pin Surface Mount Device, Body 12.7 x 9.09 mm, Pitch 1.27 mm; Mounting Type: SurfaceMount; Package Reference: SMT; Mounting Technology: SurfaceMount; Datasheet URL: http://productfinder.pulseeng.com/products/datasheets/HX1188FNL.pdf;jsessionid=D0CB5525A348FF42F5E5BE320CB10324; Height - Seated (Max): 5.99mm; Category: Transformers; Standard Package: 40; Size / Dimension: 12.70mmLx9.00mmW
U22 = CMP-1063-00180-1: 4-Channel Low Capacitance ESD Protection Array, 6-Pin SOT-23, Pb-Free, Tape and Reel; Manufacturer: On Semiconductor; Direction: Unidirectional; C Max (pF): 0.8; PPK Max (W): 0.225; Number of Lines: 4; IR Max (uA): 1; ComponentLink3Description: Package Specification; PackageVersion: Rev. B, 02/2012; PackageDescription: 6-Pin Small Outline Transistor, Body 2.85 x 1.55 mm, Pitch 0.95 mm; ComponentLink1URL: http://www.onsemi.com/; ComponentLink3URL: http://www.onsemi.com/pub_link/Collateral/527AJ.PDF; ComponentLink2URL: http://www.onsemi.com/pub_link/Collateral/CM1224-D.PDF; Packing: Tape and Reel; ComponentLink2Description: Datasheet; Mounting Technology: Surface Mount; DatasheetVersion: Rev. 5; PackageReference: SOT23-6-527AJ; ComponentLink1Description: Manufacturer URL; RoHS: Pb-Free; PartNumber: CM1224-04SO
X1 = CMP-2000-05733-1: Ultra Miniature Ceramic Glass Sealed SMD Crystal, 25 MHz, -40 to 85 degC, 4-Pin SMD, RoHS, Tape and Reel; Manufacturer: ABRACON; Frequency: 25MHz; Case Length: 3.2mm; Case Width: 2.5mm; ESR: 60Ohms; Frequency Stability: 30PPM; Tolerance: 20PPM; Case Height: 1mm; Load Capacitance: 18pF; Package Description: 4-Pin Surface Mount Device, Body 2.5 x 3.2 mm, Pitch 2.2 mm; Manufacturer URL: http://www.abracon.com/; Mounting Technology: SurfaceMount; Datasheet Version: 08/2015; Dimensions: 2.5mmWx3.2mmLx1mmH; Operating Temperature Range: -40Cto+85C; Packaging: Reel; RoHS: Details; Product Category: Crystals; Package Reference: ABM8G; Package / Case: 3.2mmx2.5mm; Brand: ABRACON; Datasheet URL: http://www.abracon.com/Resonators/ABM8G.pdf; Termination Style: SMD/SMT; Type: UltraMiniatureGlassSealedCrystal; Mounting Style: SMD/SMT; Series: ABM8G; Factory Pack Quantity: 1000

## Nets that join several sheets
3V3_Pi: Hrafn_Top (J1.1), Power_HK (P3.5)
3V3_RAW: Power_HK (C32.1 P3.3 U9.1), LC_Filter (C102.2 C103.2 C104.2 L2.2)
A3V3: Magnetometers (20 pins), U_Hrafn_Top/U_Magnetometers/MC1 (6 pins), U_Hrafn_Top/U_Magnetometers/MC2 (6 pins), Power_HK (C28.2 C29.2 R48.2 U7.5)
A5V: Magnetometers (C98.2 U26.1), U_Hrafn_Top/U_Magnetometers/MC1 (C40A.1 U12A.1), U_Hrafn_Top/U_Magnetometers/MC2 (C40B.1 U12B.1), Power_HK (5 pins)
AGND: Magnetometers (38 pins), U_Hrafn_Top/U_Magnetometers/MF8 (C100A.1 C101A.1 R130A.1), U_Hrafn_Top/U_Magnetometers/MF7 (C100B.1 C101B.1), U_Hrafn_Top/U_Magnetometers/MF6 (C100C.1 C101C.1), U_Hrafn_Top/U_Magnetometers/MF5 (C100D.1 C101D.1), U_Hrafn_Top/U_Magnetometers/MF4 (C100E.1 C101E.1 R130E.1), U_Hrafn_Top/U_Magnetometers/MF3 (C100F.1 C101F.1), U_Hrafn_Top/U_Magnetometers/MF2 (C100G.1 C101G.1), U_Hrafn_Top/U_Magnetometers/MF1 (C100H.1 C101H.1), U_Hrafn_Top/U_Magnetometers/MC1 (19 pins), U_Hrafn_Top/U_Magnetometers/MC2 (19 pins), Power_HK (6 pins)
D3V3: Hrafn_Top (13 pins), CAN_Bus (7 pins), U_Hrafn_Top/U_Magnetometers/MC1 (C47A.2 R82A.0 U13A.5), U_Hrafn_Top/U_Magnetometers/MC2 (C47B.2 R82B.0 U13B.5), Power_HK (17 pins), Clock (13 pins), Ethernet (7 pins)
D5V: Hrafn_Top (FB1.1), Power_HK (16 pins)
DGND: Hrafn_Top (19 pins), CAN_Bus (13 pins), U_Hrafn_Top/U_Magnetometers/MC1 (5 pins), U_Hrafn_Top/U_Magnetometers/MC2 (5 pins), Power_HK (72 pins), LC_Filter (C102.1 R131.1), Clock (19 pins), Ethernet (35 pins)
MAG_5V: Magnetometers (C95.2 C96.1 C97.2 U26.8), U_Hrafn_Top/U_Magnetometers/MC1 (C44A.2 U10A.1), U_Hrafn_Top/U_Magnetometers/MC2 (C44B.2 U10B.1)
SGND: CAN_Bus (8 pins), Power_HK (18 pins), Clock (J3.3 J3.6 J4.3 J4.6), Ethernet (7 pins)
1_A: U_Hrafn_Top/U_Magnetometers/MF1 (R129H.1), U_Hrafn_Top/U_Magnetometers/MC1 (C48A.2 P4A.4 R86A.2 U14A.1)
1_B: U_Hrafn_Top/U_Magnetometers/MF2 (R129G.1), U_Hrafn_Top/U_Magnetometers/MC1 (C49A.2 P4A.5 R87A.2 U15A.7)
1_C: U_Hrafn_Top/U_Magnetometers/MF3 (R129F.1), U_Hrafn_Top/U_Magnetometers/MC1 (C50A.2 P4A.6 R88A.2 U15A.1)
1_H: U_Hrafn_Top/U_Magnetometers/MF3 (R130F.1), U_Hrafn_Top/U_Magnetometers/MF2 (R130G.1), U_Hrafn_Top/U_Magnetometers/MF1 (R130H.1), U_Hrafn_Top/U_Magnetometers/MC1 (6 pins)
1_T: U_Hrafn_Top/U_Magnetometers/MF4 (R129E.1), U_Hrafn_Top/U_Magnetometers/MC1 (P4A.9 R83A.2 U12A.2)
2_A: U_Hrafn_Top/U_Magnetometers/MF5 (R129D.1), U_Hrafn_Top/U_Magnetometers/MC2 (C48B.2 P4B.4 R86B.2 U14B.1)
2_B: U_Hrafn_Top/U_Magnetometers/MF6 (R129C.1), U_Hrafn_Top/U_Magnetometers/MC2 (C49B.2 P4B.5 R87B.2 U15B.7)
2_C: U_Hrafn_Top/U_Magnetometers/MF7 (R129B.1), U_Hrafn_Top/U_Magnetometers/MC2 (C50B.2 P4B.6 R88B.2 U15B.1)
2_H: U_Hrafn_Top/U_Magnetometers/MF7 (R130B.1), U_Hrafn_Top/U_Magnetometers/MF6 (R130C.1), U_Hrafn_Top/U_Magnetometers/MF5 (R130D.1), U_Hrafn_Top/U_Magnetometers/MC2 (6 pins)
2_T: U_Hrafn_Top/U_Magnetometers/MF8 (R129A.1), U_Hrafn_Top/U_Magnetometers/MC2 (P4B.9 R83B.2 U12B.2)
CAN_CSb: Hrafn_Top (P2.9 R17.2 R37.1), CAN_Bus (U23.16)
CAN_INT: Hrafn_Top (P2.6 R22.2 R44.1), CAN_Bus (U23.11)
CAN_SLP: Hrafn_Top (R19.2), CAN_Bus (R114.2)
CLK: Magnetometers (R125.1), Power_HK (U5.7), Clock (P5.8 U19.8)
CLK_GOOD: Hrafn_Top (R11.2), Clock (P5.2 R138.2 U17.1)
CLK_SEC: Hrafn_Top (R3.1), Clock (P5.9 U19.1)
CLK_SEL: Hrafn_Top (R10.2), Clock (R138.1 U19.9)
ETH_CSb: Hrafn_Top (P2.8 R16.2 R35.1), Ethernet (U20.32)
ETH_INT: Hrafn_Top (P2.7 R14.2 R45.2), Ethernet (U20.36)
ETH_RESETb: Hrafn_Top (P1.1 R21.1 R46.1), Ethernet (U20.37)
FLAGb_3V3: Hrafn_Top (R8.1), Power_HK (R75.1 U9.7)
FLAGB_MAG: Hrafn_Top (R23.1), Magnetometers (R136.1 U26.7)
HK_CSb: Hrafn_Top (P1.9 R6.1 R38.1), Power_HK (U1.11)
MAG_ALERT: Hrafn_Top (P2.1 R20.1 R39.2), Magnetometers (U25.16)
MAG_CSb: Hrafn_Top (P1.8 R7.2 R36.1), Magnetometers (U25.18)
MAG_DRDYb: Hrafn_Top (P2.2 R9.1 R40.1), Magnetometers (U25.30)
MAG_ONb: Hrafn_Top (R4.2), Magnetometers (R127.2 U26.4)
MAG_PGOOD: Hrafn_Top (R5.2), Magnetometers (R126.1 U26.2)
MAG_RESETb: Hrafn_Top (P2.5 R2.1 R43.1), Magnetometers (U25.36)
MAG_SR: Hrafn_Top (P2.3 R26.1 R41.2), U_Hrafn_Top/U_Magnetometers/MC1 (Q2A.1 Q2A.3 U13A.2), U_Hrafn_Top/U_Magnetometers/MC2 (Q2B.1 Q2B.3 U13B.2)
MAG_STARTb: Hrafn_Top (P2.4 R1.1 R42.1), Magnetometers (U25.33)
MISO0: Hrafn_Top (P1.3 R13.1 R30.1), CAN_Bus (R116.1), Ethernet (R103.1)
MISO1: Hrafn_Top (P1.6 R24.1 R33.1), Magnetometers (U25.21), Power_HK (U1.14)
MOSI0: Hrafn_Top (P1.2 R12.1 R29.1), CAN_Bus (U23.14), Ethernet (U20.35)
MOSI1: Hrafn_Top (P1.5 R27.2 R32.1), Magnetometers (U25.20), Power_HK (U1.13)
NetC25_1: Power_HK (5 pins), LC_Filter (L2.1)
NetC99A_1: Magnetometers (U25.38), U_Hrafn_Top/U_Magnetometers/MF8 (C99A.1 C100A.2 R130A.2)
NetC99A_2: Magnetometers (U25.37), U_Hrafn_Top/U_Magnetometers/MF8 (C99A.2 C101A.2 R129A.2)
NetC99B_1: Magnetometers (U25.40), U_Hrafn_Top/U_Magnetometers/MF7 (C99B.1 C100B.2 R130B.2)
NetC99B_2: Magnetometers (U25.39), U_Hrafn_Top/U_Magnetometers/MF7 (C99B.2 C101B.2 R129B.2)
NetC99C_1: Magnetometers (U25.46), U_Hrafn_Top/U_Magnetometers/MF6 (C99C.1 C100C.2 R130C.2)
NetC99C_2: Magnetometers (U25.45), U_Hrafn_Top/U_Magnetometers/MF6 (C99C.2 C101C.2 R129C.2)
NetC99D_1: Magnetometers (U25.48), U_Hrafn_Top/U_Magnetometers/MF5 (C99D.1 C100D.2 R130D.2)
NetC99D_2: Magnetometers (U25.47), U_Hrafn_Top/U_Magnetometers/MF5 (C99D.2 C101D.2 R129D.2)
NetC99E_1: Magnetometers (U25.11), U_Hrafn_Top/U_Magnetometers/MF4 (C99E.1 C100E.2 R130E.2)
NetC99E_2: Magnetometers (U25.12), U_Hrafn_Top/U_Magnetometers/MF4 (C99E.2 C101E.2 R129E.2)
NetC99F_1: Magnetometers (U25.9), U_Hrafn_Top/U_Magnetometers/MF3 (C99F.1 C100F.2 R130F.2)
NetC99F_2: Magnetometers (U25.10), U_Hrafn_Top/U_Magnetometers/MF3 (C99F.2 C101F.2 R129F.2)
NetC99G_1: Magnetometers (U25.3), U_Hrafn_Top/U_Magnetometers/MF2 (C99G.1 C100G.2 R130G.2)
NetC99G_2: Magnetometers (U25.4), U_Hrafn_Top/U_Magnetometers/MF2 (C99G.2 C101G.2 R129G.2)
NetC99H_1: Magnetometers (U25.1), U_Hrafn_Top/U_Magnetometers/MF1 (C99H.1 C100H.2 R130H.2)
NetC99H_2: Magnetometers (U25.2), U_Hrafn_Top/U_Magnetometers/MF1 (C99H.2 C101H.2 R129H.2)
PPS: Hrafn_Top (R25.2), Clock (P5.6 U16.5)
SCLK0: Hrafn_Top (P1.4 R15.1 R31.2), CAN_Bus (U23.12), Ethernet (U20.33)
SCLK1: Hrafn_Top (P1.7 R28.2 R34.2), Magnetometers (U25.19), Power_HK (U1.15)

## Assembly variants
PopulatedComponents: not fitted J3 R132 R133 R134 R135 U20
Resistors to be replaced in rework 1: not fitted R1 R2 R3 R4 R5 R6 R7 R8 R9 R10 R11 R12 R13 R14 R15 R16 R17 R18 R19 R20 R21 R22 R23 R24 R25 R26 R27 R28 R102 R103 R105 R113 R115 R116 R117 R118 R119 R120 R121 R122 R123 R124 R125 R139 R140
Hrafn FM: not fitted FB6 R138; alternate parts U19 -> PI3USB4000